# Altium schematic sheet АЧАД.52хххх.ххх.SchDoc: Наименование
size 209 x 297 mm; CheckedBy: Бондарчук ПС; Author: Ільницька ЛЛ; CompanyName: ТОВ "Радіонікс"; SheetNumber: 1; SheetTotal: 1; PageSetup: Record=PageOptions|CenterHorizontal=True|CenterVertical=True|PrintScale=0.99|XCorrection=1.00|YCorrection=1.00|PrintKind=1|BorderSize=5000000|LeftOffset=0|BottomOffset=0|Orientation=1|PaperLength=1000|PaperWidth=1000|Scale=100|PaperSource=7|PrintQuality=-4|MediaType=1|DitherType=10|PrintScaleMode=1|PaperKind=A4; DecimalNumber: АЧАД.52хххх.ххх Э3; MainDevice: АЧАД.52хххх.ххх; Name: Двигун; DecimalNumber_MIRROR: ххх.хххх25.ДАЧА; DocumentName: АЧАД.52хххх.ххх.SCHDOC
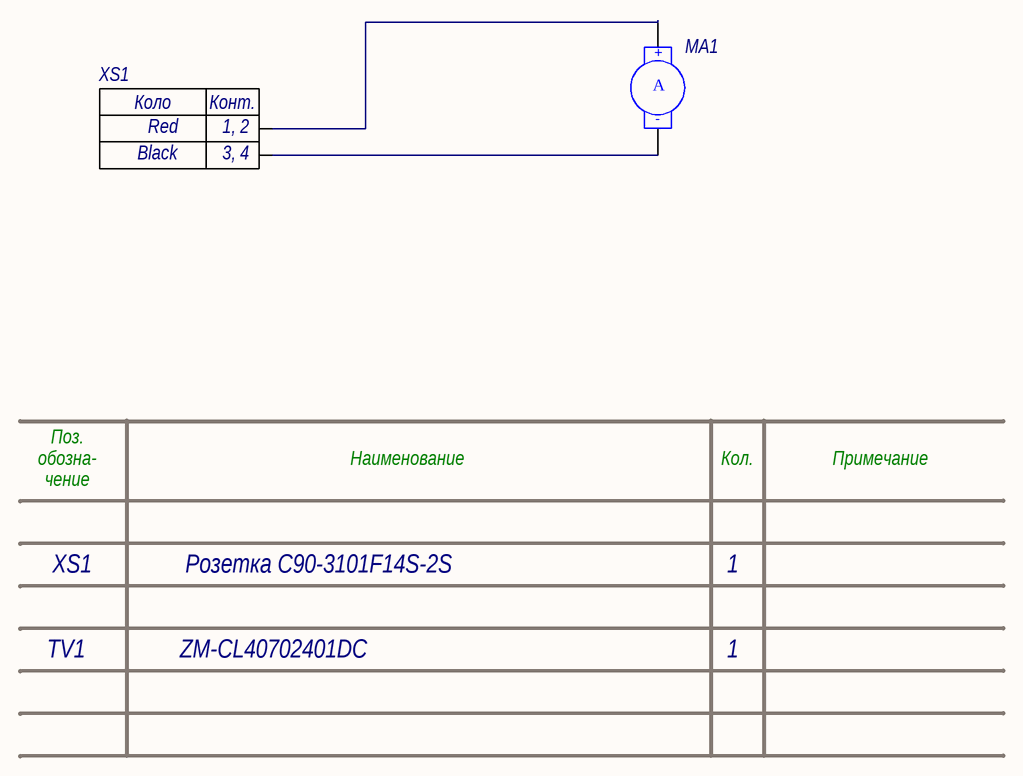
[diagram p0: АЧАД.52хххх.ххх.SchDoc]

## Parts
MA1  Motor Servo  [RAD-0.4]  (value not drawn)
XS1  M20-9770242  (value not drawn)

## Nets
NetMA1_1: MA1.1(+) XS1.1(1_,2)
NetMA1_2: MA1.2(-) XS1.2(3_,4)

## Notes on the sheet
- Black
- Red
- (near XS1) 1, 2
- (near XS1) 3, 4
- Поз.
- обозна-
- чение
- Наименование
- Кол.
- Примечание
- XS1
- Розетка C90-3101F14S-2S
- 1
- TV1
- ZM-CL40702401DC
- Перв.примен.
- Справ.№
- Подп. и дата
- Инв.№ дубл.
- Взам.инв.№
- Подп.и дата
- Разраб.
- Изм.
- Лист
- № докум.
- Подп.
- Дата
- Лит.
- Масштаб
- Масса
- Т.контр.
- Пров.
- СХЕМА   ЕЛЕКТРИЧНА
- ПРИНЦИПОВА
- Листов
- Инв.№ подл.
- Утв.
- Н.контр.
- Нач.сект.
- Копировал
- Формат  A4
- (in symbol M20-9770242) Коло; Конт.
- (in symbol Motor Servo) A

## Library data of the parts
MA1 = Motor Servo: Servo Motor; Published: 24-Mar-1999; LatestRevisionDate: 17-Jul-2002; LatestRevisionNote: Re-released for DXP Platform.; PackageReference: RAD-0.4; Publisher: Altium Limited; PackageDescription: Radial Cap, Thru-Hole; 2 Leads; 0.4 in Pin Spacing